# EAGLE schematic kb (EAGLE 9.0.1)
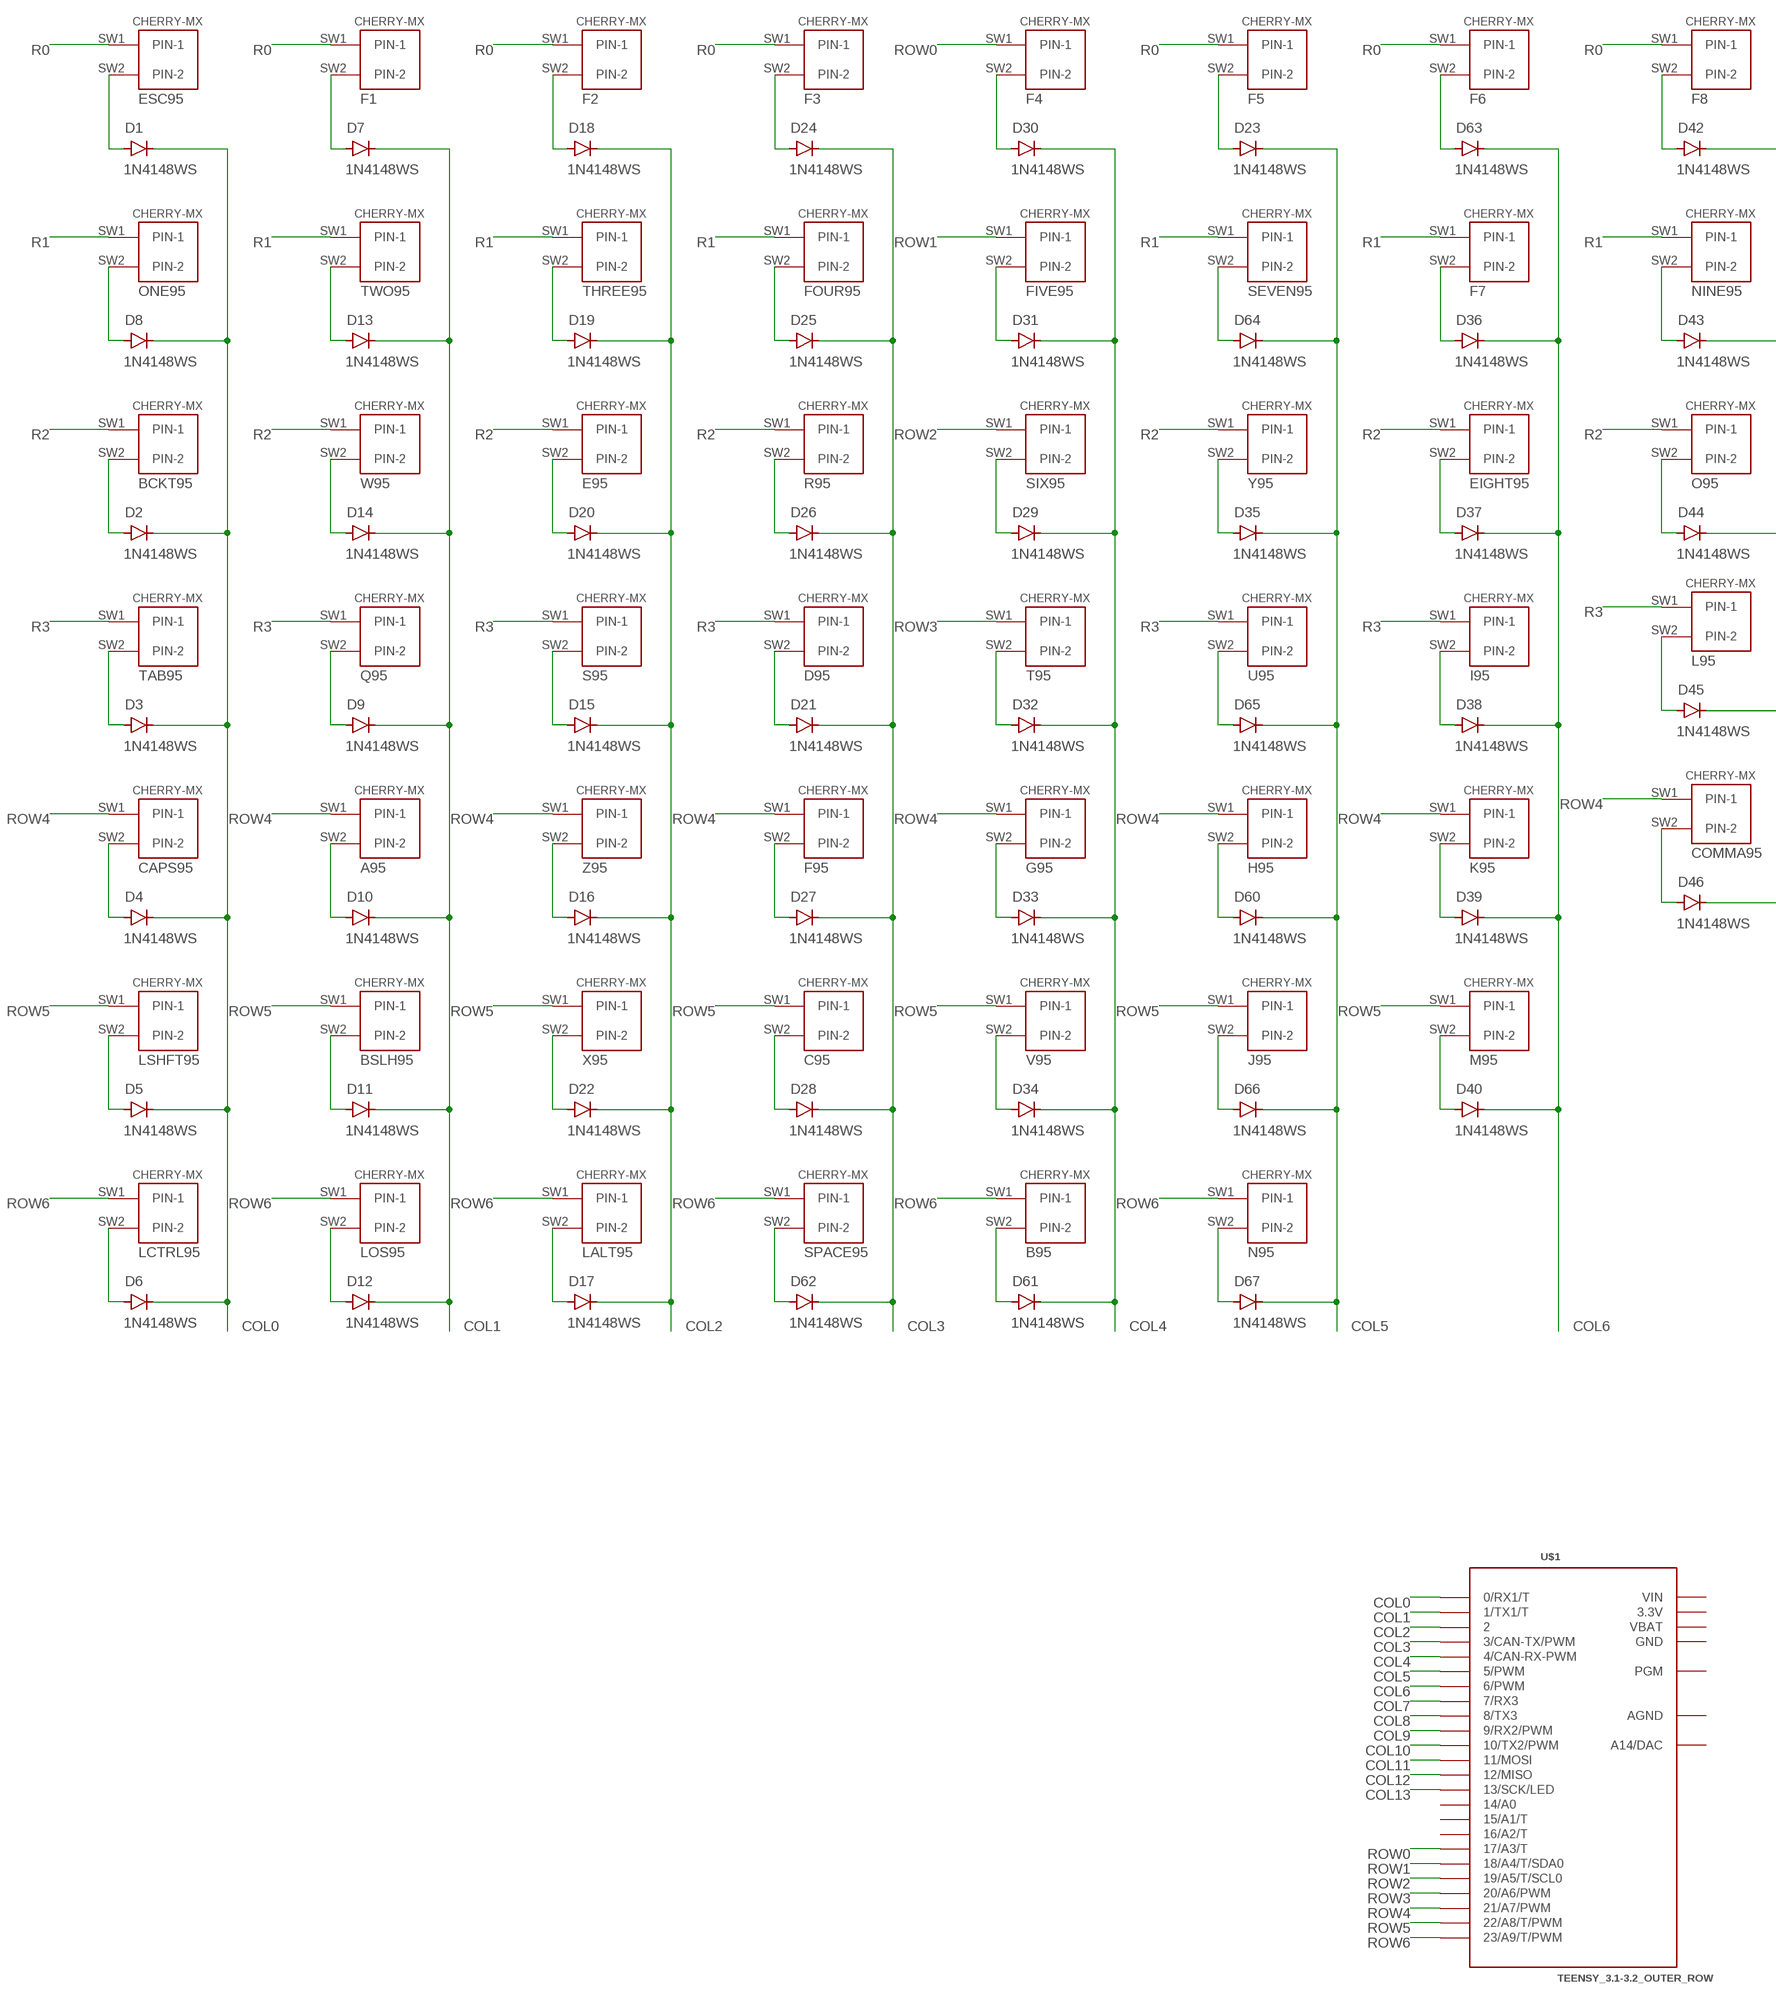
[diagram p0: schematic, sheet 1, part 1 of 2]
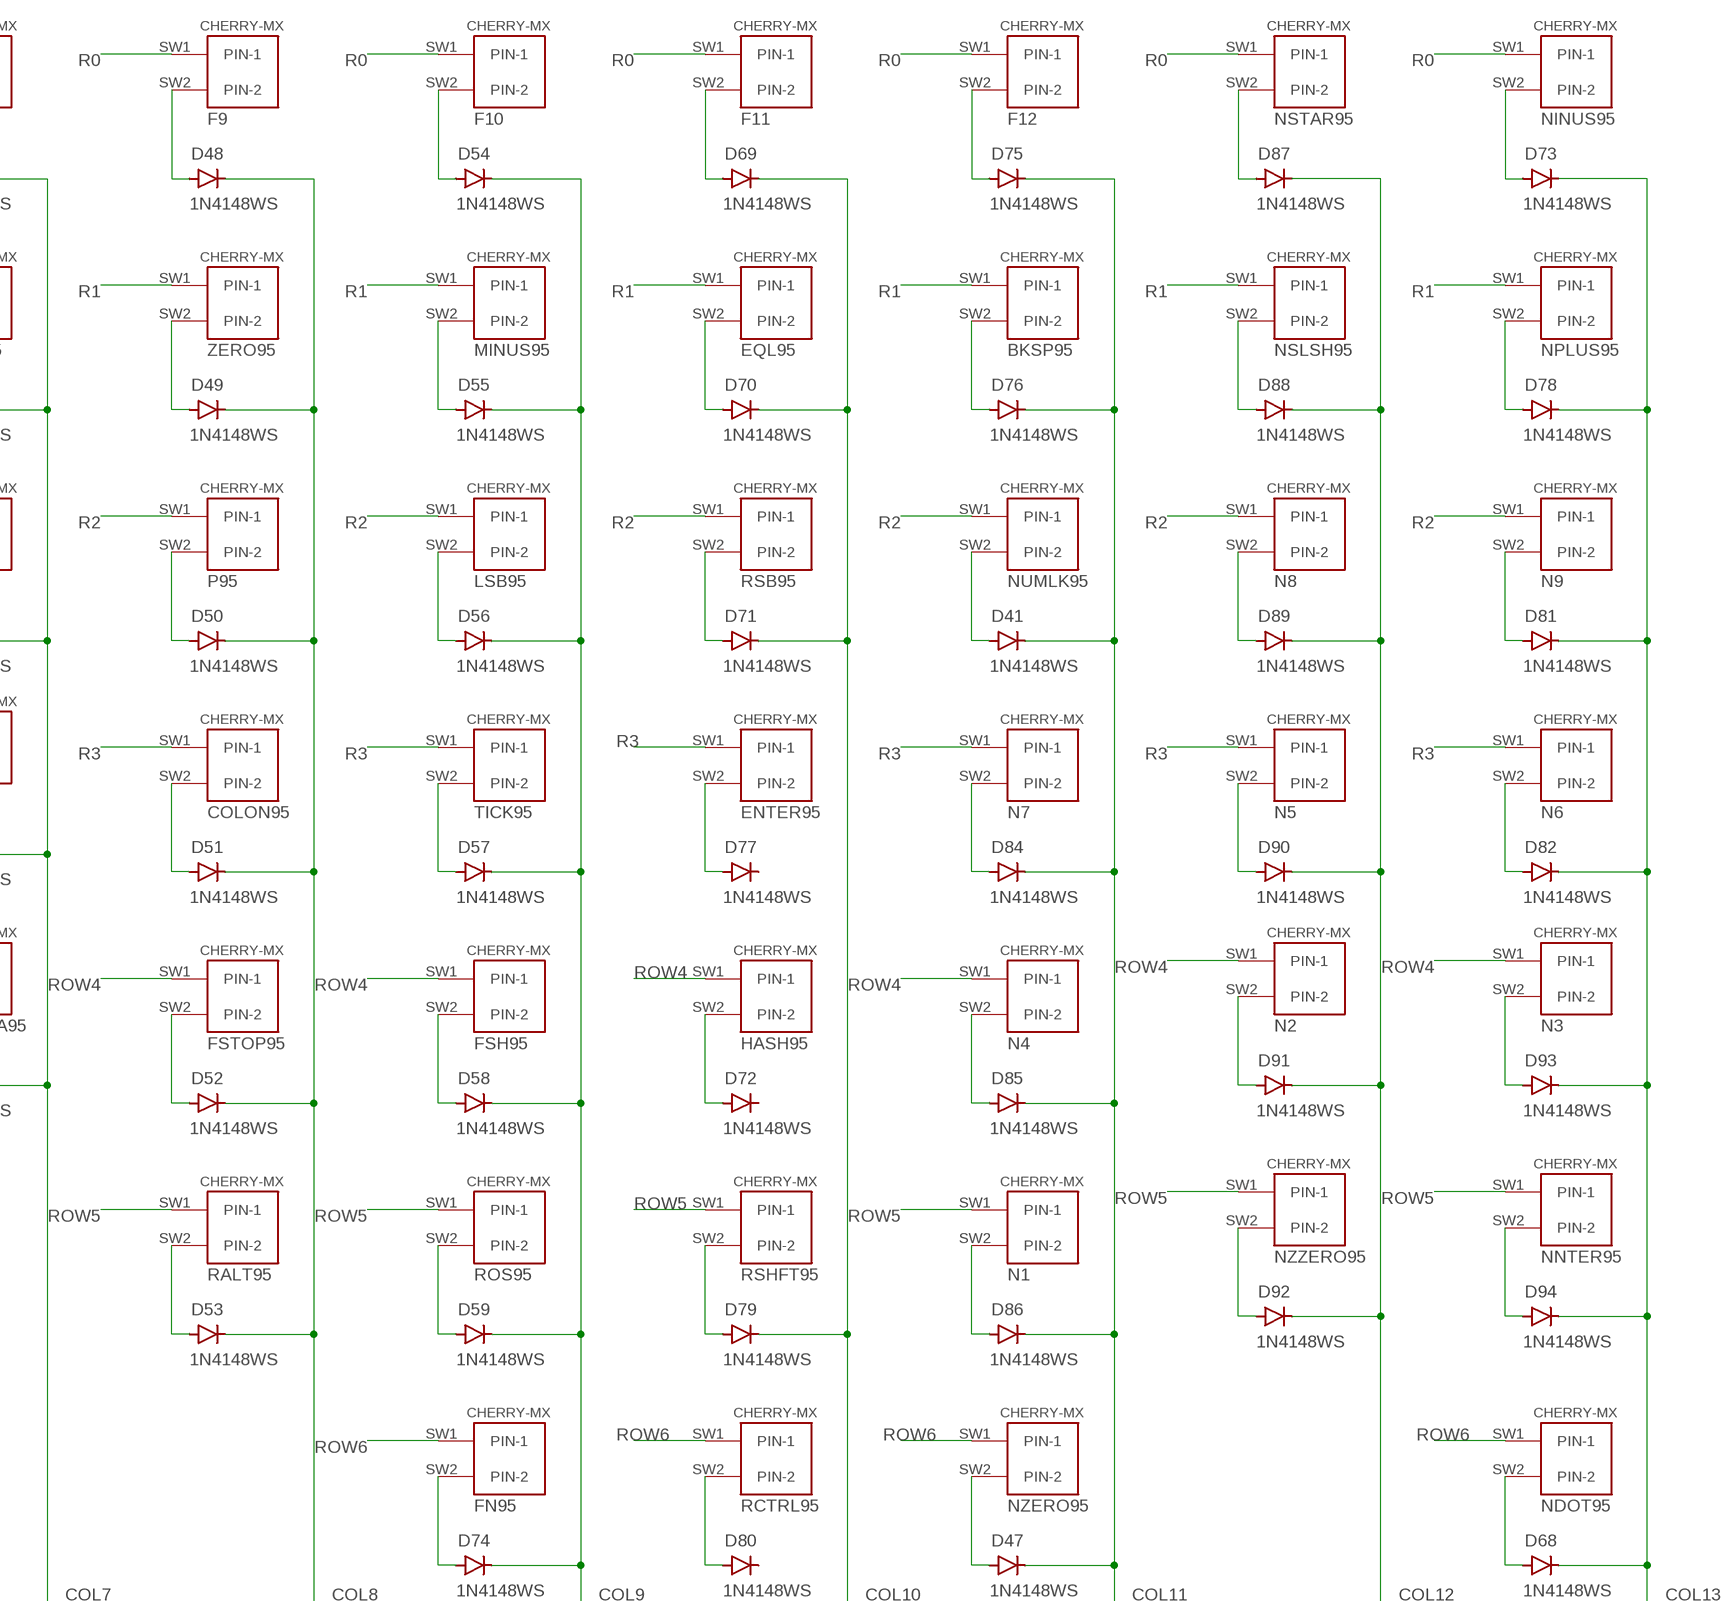
[diagram p1: schematic, sheet 1, part 2 of 2]

## Parts
A95  CHERRY-MX  [CHERRY-MX]
B95  CHERRY-MX  [CHERRY-MX]
BCKT95  CHERRY-MX  [CHERRY-MX]
BKSP95  CHERRY-MX  [CHERRY-MX]
BSLH95  CHERRY-MX  [CHERRY-MX]
C95  CHERRY-MX  [CHERRY-MX]
CAPS95  CHERRY-MX  [CHERRY-MX]
COLON95  CHERRY-MX  [CHERRY-MX]
COMMA95  CHERRY-MX  [CHERRY-MX]
D1  1N4148WS  [SOD-323]
D2  1N4148WS  [SOD-323]
D3  1N4148WS  [SOD-323]
D4  1N4148WS  [SOD-323]
D5  1N4148WS  [SOD-323]
D6  1N4148WS  [SOD-323]
D7  1N4148WS  [SOD-323]
D8  1N4148WS  [SOD-323]
D9  1N4148WS  [SOD-323]
D10  1N4148WS  [SOD-323]
D11  1N4148WS  [SOD-323]
D12  1N4148WS  [SOD-323]
D13  1N4148WS  [SOD-323]
D14  1N4148WS  [SOD-323]
D15  1N4148WS  [SOD-323]
D16  1N4148WS  [SOD-323]
D17  1N4148WS  [SOD-323]
D18  1N4148WS  [SOD-323]
D19  1N4148WS  [SOD-323]
D20  1N4148WS  [SOD-323]
D21  1N4148WS  [SOD-323]
D22  1N4148WS  [SOD-323]
D23  1N4148WS  [SOD-323]
D24  1N4148WS  [SOD-323]
D25  1N4148WS  [SOD-323]
D26  1N4148WS  [SOD-323]
D27  1N4148WS  [SOD-323]
D28  1N4148WS  [SOD-323]
D29  1N4148WS  [SOD-323]
D30  1N4148WS  [SOD-323]
D31  1N4148WS  [SOD-323]
D32  1N4148WS  [SOD-323]
D33  1N4148WS  [SOD-323]
D34  1N4148WS  [SOD-323]
D35  1N4148WS  [SOD-323]
D36  1N4148WS  [SOD-323]
D37  1N4148WS  [SOD-323]
D38  1N4148WS  [SOD-323]
D39  1N4148WS  [SOD-323]
D40  1N4148WS  [SOD-323]
D41  1N4148WS  [SOD-323]
D42  1N4148WS  [SOD-323]
D43  1N4148WS  [SOD-323]
D44  1N4148WS  [SOD-323]
D45  1N4148WS  [SOD-323]
D46  1N4148WS  [SOD-323]
D47  1N4148WS  [SOD-323]
D48  1N4148WS  [SOD-323]
D49  1N4148WS  [SOD-323]
D50  1N4148WS  [SOD-323]
D51  1N4148WS  [SOD-323]
D52  1N4148WS  [SOD-323]
D53  1N4148WS  [SOD-323]
D54  1N4148WS  [SOD-323]
D55  1N4148WS  [SOD-323]
D56  1N4148WS  [SOD-323]
D57  1N4148WS  [SOD-323]
D58  1N4148WS  [SOD-323]
D59  1N4148WS  [SOD-323]
D60  1N4148WS  [SOD-323]
D61  1N4148WS  [SOD-323]
D62  1N4148WS  [SOD-323]
D63  1N4148WS  [SOD-323]
D64  1N4148WS  [SOD-323]
D65  1N4148WS  [SOD-323]
D66  1N4148WS  [SOD-323]
D67  1N4148WS  [SOD-323]
D68  1N4148WS  [SOD-323]
D69  1N4148WS  [SOD-323]
D70  1N4148WS  [SOD-323]
D71  1N4148WS  [SOD-323]
D72  1N4148WS  [SOD-323]
D73  1N4148WS  [SOD-323]
D74  1N4148WS  [SOD-323]
D75  1N4148WS  [SOD-323]
D76  1N4148WS  [SOD-323]
D77  1N4148WS  [SOD-323]
D78  1N4148WS  [SOD-323]
D79  1N4148WS  [SOD-323]
D80  1N4148WS  [SOD-323]
D81  1N4148WS  [SOD-323]
D82  1N4148WS  [SOD-323]
D84  1N4148WS  [SOD-323]
D85  1N4148WS  [SOD-323]
D86  1N4148WS  [SOD-323]
D87  1N4148WS  [SOD-323]
D88  1N4148WS  [SOD-323]
D89  1N4148WS  [SOD-323]
D90  1N4148WS  [SOD-323]
D91  1N4148WS  [SOD-323]
D92  1N4148WS  [SOD-323]
D93  1N4148WS  [SOD-323]
D94  1N4148WS  [SOD-323]
D95  CHERRY-MX  [CHERRY-MX]
E95  CHERRY-MX  [CHERRY-MX]
EIGHT95  CHERRY-MX  [CHERRY-MX]
ENTER95  CHERRY-MX  [CHERRY-MX]
EQL95  CHERRY-MX  [CHERRY-MX]
ESC95  CHERRY-MX  [CHERRY-MX]
F1  CHERRY-MX  [CHERRY-MX]
F2  CHERRY-MX  [CHERRY-MX]
F3  CHERRY-MX  [CHERRY-MX]
F4  CHERRY-MX  [CHERRY-MX]
F5  CHERRY-MX  [CHERRY-MX]
F6  CHERRY-MX  [CHERRY-MX]
F7  CHERRY-MX  [CHERRY-MX]
F8  CHERRY-MX  [CHERRY-MX]
F9  CHERRY-MX  [CHERRY-MX]
F10  CHERRY-MX  [CHERRY-MX]
F11  CHERRY-MX  [CHERRY-MX]
F12  CHERRY-MX  [CHERRY-MX]
F95  CHERRY-MX  [CHERRY-MX]
FIVE95  CHERRY-MX  [CHERRY-MX]
FN95  CHERRY-MX  [CHERRY-MX]
FOUR95  CHERRY-MX  [CHERRY-MX]
FSH95  CHERRY-MX  [CHERRY-MX]
FSTOP95  CHERRY-MX  [CHERRY-MX]
G95  CHERRY-MX  [CHERRY-MX]
H95  CHERRY-MX  [CHERRY-MX]
HASH95  CHERRY-MX  [CHERRY-MX]
I95  CHERRY-MX  [CHERRY-MX]
J95  CHERRY-MX  [CHERRY-MX]
K95  CHERRY-MX  [CHERRY-MX]
L95  CHERRY-MX  [CHERRY-MX]
LALT95  CHERRY-MX  [CHERRY-MX]
LCTRL95  CHERRY-MX  [CHERRY-MX]
LOS95  CHERRY-MX  [CHERRY-MX]
LSB95  CHERRY-MX  [CHERRY-MX]
LSHFT95  CHERRY-MX  [CHERRY-MX]
M95  CHERRY-MX  [CHERRY-MX]
MINUS95  CHERRY-MX  [CHERRY-MX]
N1  CHERRY-MX  [CHERRY-MX]
N2  CHERRY-MX  [CHERRY-MX]
N3  CHERRY-MX  [CHERRY-MX]
N4  CHERRY-MX  [CHERRY-MX]
N5  CHERRY-MX  [CHERRY-MX]
N6  CHERRY-MX  [CHERRY-MX]
N7  CHERRY-MX  [CHERRY-MX]
N8  CHERRY-MX  [CHERRY-MX]
N9  CHERRY-MX  [CHERRY-MX]
N95  CHERRY-MX  [CHERRY-MX]
NDOT95  CHERRY-MX  [CHERRY-MX]
NINE95  CHERRY-MX  [CHERRY-MX]
NINUS95  CHERRY-MX  [CHERRY-MX]
NNTER95  CHERRY-MX  [CHERRY-MX]
NPLUS95  CHERRY-MX  [CHERRY-MX]
NSLSH95  CHERRY-MX  [CHERRY-MX]
NSTAR95  CHERRY-MX  [CHERRY-MX]
NUMLK95  CHERRY-MX  [CHERRY-MX]
NZERO95  CHERRY-MX  [CHERRY-MX]
NZZERO95  CHERRY-MX  [CHERRY-MX]
O95  CHERRY-MX  [CHERRY-MX]
ONE95  CHERRY-MX  [CHERRY-MX]
P95  CHERRY-MX  [CHERRY-MX]
Q95  CHERRY-MX  [CHERRY-MX]
R95  CHERRY-MX  [CHERRY-MX]
RALT95  CHERRY-MX  [CHERRY-MX]
RCTRL95  CHERRY-MX  [CHERRY-MX]
ROS95  CHERRY-MX  [CHERRY-MX]
RSB95  CHERRY-MX  [CHERRY-MX]
RSHFT95  CHERRY-MX  [CHERRY-MX]
S95  CHERRY-MX  [CHERRY-MX]
SEVEN95  CHERRY-MX  [CHERRY-MX]
SIX95  CHERRY-MX  [CHERRY-MX]
SPACE95  CHERRY-MX  [CHERRY-MX]
T95  CHERRY-MX  [CHERRY-MX]
TAB95  CHERRY-MX  [CHERRY-MX]
THREE95  CHERRY-MX  [CHERRY-MX]
TICK95  CHERRY-MX  [CHERRY-MX]
TWO95  CHERRY-MX  [CHERRY-MX]
U95  CHERRY-MX  [CHERRY-MX]
U$1  TEENSY_3.1-3.2_OUTER_ROW  [TEENSY_3.0-3.2&LC_OUTER_ROW]
V95  CHERRY-MX  [CHERRY-MX]
W95  CHERRY-MX  [CHERRY-MX]
X95  CHERRY-MX  [CHERRY-MX]
Y95  CHERRY-MX  [CHERRY-MX]
Z95  CHERRY-MX  [CHERRY-MX]
ZERO95  CHERRY-MX  [CHERRY-MX]

## Nets
COL0: D1.C D2.C D3.C D4.C D5.C D6.C D8.C U$1.0(0/RX1/T)
COL1: D7.C D9.C D10.C D11.C D12.C D13.C D14.C U$1.1(1/TX1/T)
COL2: D15.C D16.C D17.C D18.C D19.C D20.C D22.C U$1.2
COL3: D21.C D24.C D25.C D26.C D27.C D28.C D62.C U$1.3(3/CAN-TX/PWM)
COL4: D29.C D30.C D31.C D32.C D33.C D34.C D61.C U$1.4(4/CAN-RX-PWM)
COL5: D23.C D35.C D60.C D64.C D65.C D66.C D67.C U$1.5(5/PWM)
COL6: D36.C D37.C D38.C D39.C D40.C D63.C U$1.6(6/PWM)
COL7: D42.C D43.C D44.C D45.C D46.C U$1.7(7/RX3)
COL8: D48.C D49.C D50.C D51.C D52.C D53.C U$1.8(8/TX3)
COL9: D54.C D55.C D56.C D57.C D58.C D59.C D74.C U$1.9(9/RX2/PWM)
COL10: D69.C D70.C D71.C D79.C U$1.10(10/TX2/PWM)
COL11: D41.C D47.C D75.C D76.C D84.C D85.C D86.C U$1.11(11/MOSI)
COL12: D87.C D88.C D89.C D90.C D91.C D92.C U$1.12(12/MISO)
COL13: D68.C D73.C D78.C D81.C D82.C D93.C D94.C U$1.13(13/SCK/LED)
N$1: D1.A ESC95.SW2(PIN-2)
N$2: BCKT95.SW2(PIN-2) D2.A
N$3: D3.A TAB95.SW2(PIN-2)
N$4: CAPS95.SW2(PIN-2) D4.A
N$5: D5.A LSHFT95.SW2(PIN-2)
N$6: D6.A LCTRL95.SW2(PIN-2)
N$7: D8.A ONE95.SW2(PIN-2)
N$8: D9.A Q95.SW2(PIN-2)
N$9: A95.SW2(PIN-2) D10.A
N$10: BSLH95.SW2(PIN-2) D11.A
N$11: D12.A LOS95.SW2(PIN-2)
N$12: D13.A TWO95.SW2(PIN-2)
N$13: D14.A W95.SW2(PIN-2)
N$14: D15.A S95.SW2(PIN-2)
N$15: D16.A Z95.SW2(PIN-2)
N$16: D17.A LALT95.SW2(PIN-2)
N$17: D7.A F1.SW2(PIN-2)
N$18: D19.A THREE95.SW2(PIN-2)
N$19: D20.A E95.SW2(PIN-2)
N$20: D21.A D95.SW2(PIN-2)
N$21: D22.A X95.SW2(PIN-2)
N$22: D29.A SIX95.SW2(PIN-2)
N$23: D18.A F2.SW2(PIN-2)
N$24: D25.A FOUR95.SW2(PIN-2)
N$25: D26.A R95.SW2(PIN-2)
N$26: D27.A F95.SW2(PIN-2)
N$27: C95.SW2(PIN-2) D28.A
N$28: D35.A Y95.SW2(PIN-2)
N$29: D24.A F3.SW2(PIN-2)
N$30: D31.A FIVE95.SW2(PIN-2)
N$31: D32.A T95.SW2(PIN-2)
N$32: D33.A G95.SW2(PIN-2)
N$33: D34.A V95.SW2(PIN-2)
N$34: D60.A H95.SW2(PIN-2)
N$35: D30.A F4.SW2(PIN-2)
N$36: D37.A EIGHT95.SW2(PIN-2)
N$37: D38.A I95.SW2(PIN-2)
N$38: D39.A K95.SW2(PIN-2)
N$39: D40.A M95.SW2(PIN-2)
N$40: D41.A NUMLK95.SW2(PIN-2)
N$41: D36.A F7.SW2(PIN-2)
N$42: D43.A NINE95.SW2(PIN-2)
N$43: D44.A O95.SW2(PIN-2)
N$44: D45.A L95.SW2(PIN-2)
N$45: COMMA95.SW2(PIN-2) D46.A
N$46: D47.A NZERO95.SW2(PIN-2)
N$47: D42.A F8.SW2(PIN-2)
N$48: D49.A ZERO95.SW2(PIN-2)
N$49: D50.A P95.SW2(PIN-2)
N$50: COLON95.SW2(PIN-2) D51.A
N$51: D52.A FSTOP95.SW2(PIN-2)
N$52: D53.A RALT95.SW2(PIN-2)
N$53: D48.A F9.SW2(PIN-2)
N$54: D55.A MINUS95.SW2(PIN-2)
N$55: D56.A LSB95.SW2(PIN-2)
N$56: D57.A TICK95.SW2(PIN-2)
N$57: D58.A FSH95.SW2(PIN-2)
N$58: D59.A ROS95.SW2(PIN-2)
N$59: D54.A F10.SW2(PIN-2)
N$60: B95.SW2(PIN-2) D61.A
N$61: D62.A SPACE95.SW2(PIN-2)
N$62: D23.A F5.SW2(PIN-2)
N$63: D64.A SEVEN95.SW2(PIN-2)
N$64: D65.A U95.SW2(PIN-2)
N$65: D66.A J95.SW2(PIN-2)
N$66: D67.A N95.SW2(PIN-2)
N$67: D68.A NDOT95.SW2(PIN-2)
N$68: D63.A F6.SW2(PIN-2)
N$69: D70.A EQL95.SW2(PIN-2)
N$70: D71.A RSB95.SW2(PIN-2)
N$71: D72.A HASH95.SW2(PIN-2)
N$72: D78.A NPLUS95.SW2(PIN-2)
N$73: D74.A FN95.SW2(PIN-2)
N$74: D69.A F11.SW2(PIN-2)
N$75: BKSP95.SW2(PIN-2) D76.A
N$76: D77.A ENTER95.SW2(PIN-2)
N$77: D81.A N9.SW2(PIN-2)
N$78: D79.A RSHFT95.SW2(PIN-2)
N$79: D80.A RCTRL95.SW2(PIN-2)
N$80: D75.A F12.SW2(PIN-2)
N$81: D82.A N6.SW2(PIN-2)
N$83: D84.A N7.SW2(PIN-2)
N$84: D85.A N4.SW2(PIN-2)
N$85: D86.A N1.SW2(PIN-2)
N$86: D93.A N3.SW2(PIN-2)
N$87: D88.A NSLSH95.SW2(PIN-2)
N$88: D89.A N8.SW2(PIN-2)
N$89: D90.A N5.SW2(PIN-2)
N$90: D91.A N2.SW2(PIN-2)
N$91: D92.A NZZERO95.SW2(PIN-2)
N$92: D87.A NSTAR95.SW2(PIN-2)
N$93: D94.A NNTER95.SW2(PIN-2)
N$94: D73.A NINUS95.SW2(PIN-2)
R0: ESC95.SW1(PIN-1) F1.SW1(PIN-1) F2.SW1(PIN-1) F3.SW1(PIN-1) F5.SW1(PIN-1) F6.SW1(PIN-1) F8.SW1(PIN-1) F9.SW1(PIN-1) F10.SW1(PIN-1) F11.SW1(PIN-1) F12.SW1(PIN-1) NINUS95.SW1(PIN-1) NSTAR95.SW1(PIN-1)
R1: BKSP95.SW1(PIN-1) EQL95.SW1(PIN-1) F7.SW1(PIN-1) FOUR95.SW1(PIN-1) MINUS95.SW1(PIN-1) NINE95.SW1(PIN-1) NPLUS95.SW1(PIN-1) NSLSH95.SW1(PIN-1) ONE95.SW1(PIN-1) SEVEN95.SW1(PIN-1) THREE95.SW1(PIN-1) TWO95.SW1(PIN-1) ZERO95.SW1(PIN-1)
R2: BCKT95.SW1(PIN-1) E95.SW1(PIN-1) EIGHT95.SW1(PIN-1) LSB95.SW1(PIN-1) N8.SW1(PIN-1) N9.SW1(PIN-1) NUMLK95.SW1(PIN-1) O95.SW1(PIN-1) P95.SW1(PIN-1) R95.SW1(PIN-1) RSB95.SW1(PIN-1) W95.SW1(PIN-1) Y95.SW1(PIN-1)
R3: COLON95.SW1(PIN-1) D95.SW1(PIN-1) ENTER95.SW1(PIN-1) I95.SW1(PIN-1) L95.SW1(PIN-1) N5.SW1(PIN-1) N6.SW1(PIN-1) N7.SW1(PIN-1) Q95.SW1(PIN-1) S95.SW1(PIN-1) TAB95.SW1(PIN-1) TICK95.SW1(PIN-1) U95.SW1(PIN-1)
ROW0: F4.SW1(PIN-1) U$1.17/A3(17/A3/T)
ROW1: FIVE95.SW1(PIN-1) U$1.18/A4(18/A4/T/SDA0)
ROW2: SIX95.SW1(PIN-1) U$1.19/A5(19/A5/T/SCL0)
ROW3: T95.SW1(PIN-1) U$1.20/A6(20/A6/PWM)
ROW4: A95.SW1(PIN-1) CAPS95.SW1(PIN-1) COMMA95.SW1(PIN-1) F95.SW1(PIN-1) FSH95.SW1(PIN-1) FSTOP95.SW1(PIN-1) G95.SW1(PIN-1) H95.SW1(PIN-1) HASH95.SW1(PIN-1) K95.SW1(PIN-1) N2.SW1(PIN-1) N3.SW1(PIN-1) N4.SW1(PIN-1) U$1.21/A7(21/A7/PWM) Z95.SW1(PIN-1)
ROW5: BSLH95.SW1(PIN-1) C95.SW1(PIN-1) J95.SW1(PIN-1) LSHFT95.SW1(PIN-1) M95.SW1(PIN-1) N1.SW1(PIN-1) NNTER95.SW1(PIN-1) NZZERO95.SW1(PIN-1) RALT95.SW1(PIN-1) ROS95.SW1(PIN-1) RSHFT95.SW1(PIN-1) U$1.22/A8(22/A8/T/PWM) V95.SW1(PIN-1) X95.SW1(PIN-1)
ROW6: B95.SW1(PIN-1) FN95.SW1(PIN-1) LALT95.SW1(PIN-1) LCTRL95.SW1(PIN-1) LOS95.SW1(PIN-1) N95.SW1(PIN-1) NDOT95.SW1(PIN-1) NZERO95.SW1(PIN-1) RCTRL95.SW1(PIN-1) SPACE95.SW1(PIN-1) U$1.23/A9(23/A9/T/PWM)
Unconnected: D72.C D77.C D80.C U$1.14/A0 U$1.15/A1(15/A1/T) U$1.16/A2(16/A2/T) U$1.PGM U$1.RESET/DAC(A14/DAC)

## Power pins joined to a net without a drawn wire
3.3V: U$1.3.3V U$1.3.3V1(3.3V)
AGND: U$1.AGND
GND: U$1.GND U$1.GND1(GND)
VBAT: U$1.VBAT
VIN: U$1.VIN

## Library data of the parts
A95 B95 BCKT95 BKSP95 BSLH95 C95 CAPS95 COLON95 COMMA95 D95 E95 EIGHT95 ENTER95 EQL95 ESC95 F1-F12 F95 FIVE95 FN95 FOUR95 FSH95 FSTOP95 G95 H95 HASH95 I95 J95 K95 L95 LALT95 LCTRL95 LOS95 LSB95 LSHFT95 M95 MINUS95 N1-N9 N95 NDOT95 NINE95 NINUS95 NNTER95 NPLUS95 NSLSH95 NSTAR95 NUMLK95 NZERO95 NZZERO95 O95 ONE95 P95 Q95 R95 RALT95 RCTRL95 ROS95 RSB95 RSHFT95 S95 SEVEN95 SIX95 SPACE95 T95 TAB95 THREE95 TICK95 TWO95 U95 V95 W95 X95 Y95 Z95 ZERO95 = cherrymx:CHERRY-MX: Cherry MX series keyswitch
D1-D82 D84-D94 = Diodes:1N4148WS: DIODE GEN PURP 75V 150MA SOD323F Manufacturer's datasheet <https://www.onsemi.com/pub/Collateral/1N914BWS-D.pdf>; CREATED_BY: PCBLayout.com; DIGIKEY_PART_NUMBER: 1N4148WSFSTR-ND; MANUFACTURER: Diodes Incorporated; MPN: 1N4148WS; PACKAGE: SOD-323
U$1 = Teensy_3_and_LC_Series_Boards_v1.4:TEENSY_3.1-3.2_OUTER_ROW: Footprint for Teensy 3.1 or 3.2 board using all pin connections on the outer perimeter